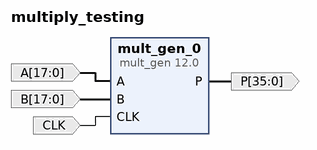
[diagram p0: block diagram of the top level]
# Vivado block design multiply_testing, xck26-sfvc784-2LV-c, Vivado 2022.2
create_bd_design multiply_testing

create_bd_port -dir I -from 17 -to 0 A
create_bd_port -dir I -from 17 -to 0 B
create_bd_port -dir O -from 35 -to 0 P
create_bd_port -dir I CLK

create_bd_cell -type ip -vlnv xilinx.com:ip:mult_gen:12.0 mult_gen_0

# ---- connections ----

connect_bd_net [get_bd_ports A] [get_bd_pins mult_gen_0/A]
connect_bd_net [get_bd_ports B] [get_bd_pins mult_gen_0/B]
connect_bd_net [get_bd_ports CLK] [get_bd_pins mult_gen_0/CLK]
connect_bd_net [get_bd_pins mult_gen_0/P] [get_bd_ports P]

validate_bd_design
save_bd_design
